# Altium project BTSM_Power_v1.PrjPcb
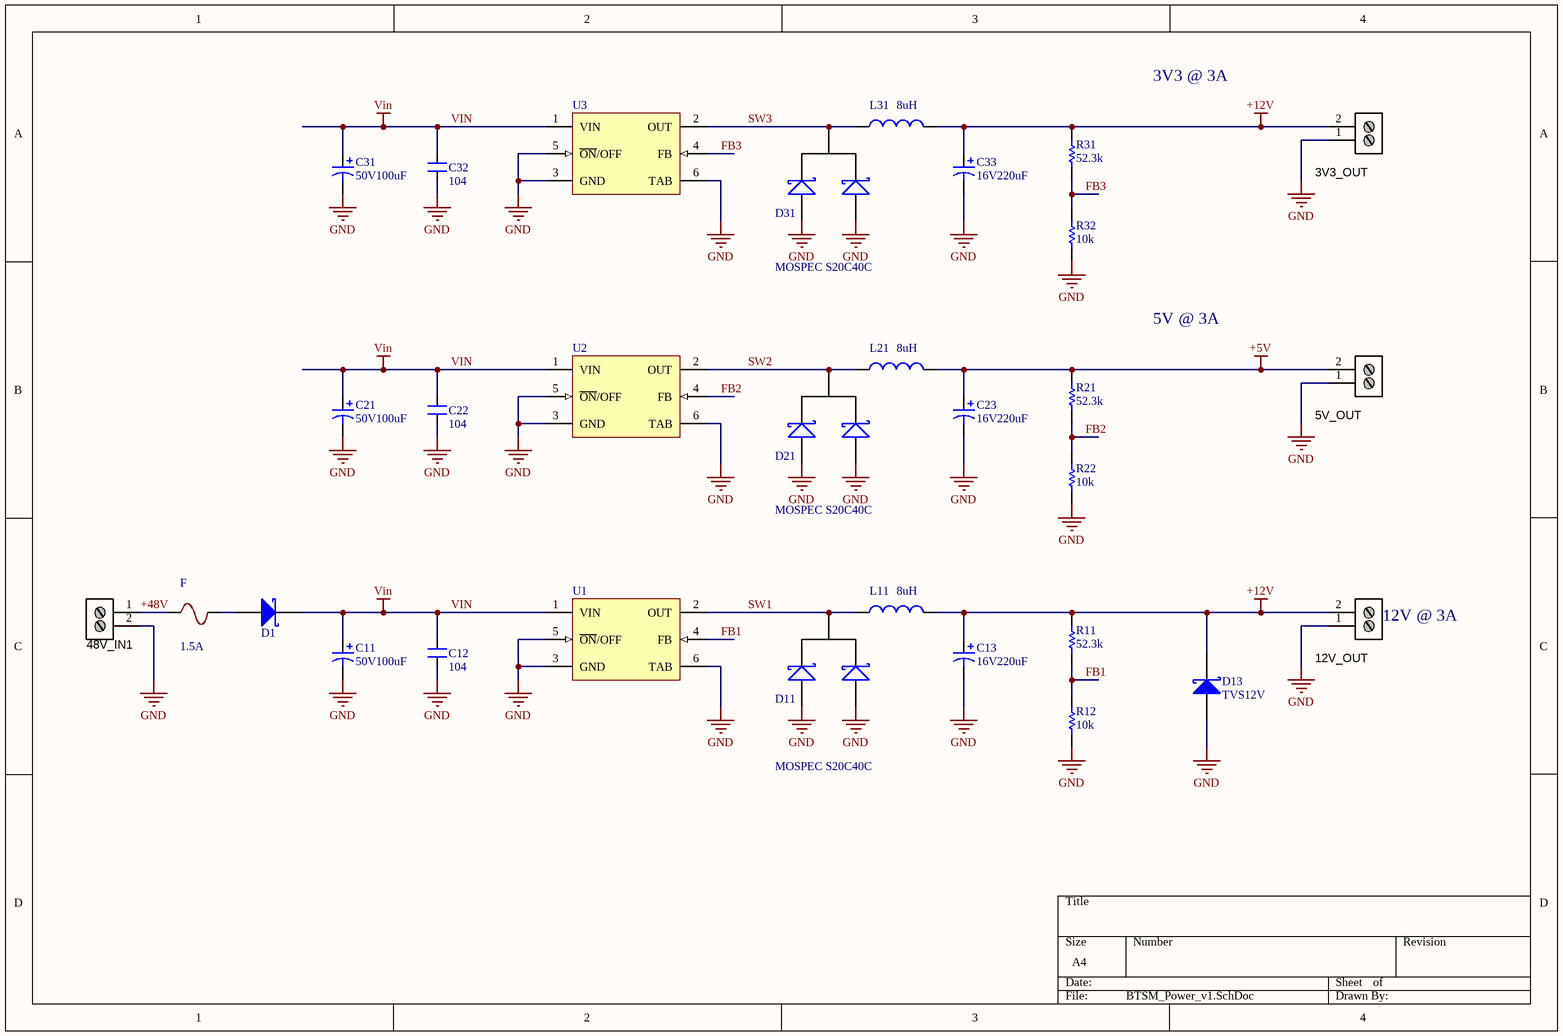
[diagram p0: BTSM_Power_v1.SchDoc]
1 sheet, 31 parts. Net scope: global (net labels, ports and power ports of the same name join across sheets).
Board file: BTSM_Power_v1.PcbDoc

## Sheet BTSM_Power_v1.SchDoc
size A4

### Parts
3V3_OUT  Stackable ScrewTerm  [2P_PCB_ScrewTerm_200mil]  (value not drawn)
5V_OUT  Stackable ScrewTerm  [2P_PCB_ScrewTerm_200mil]  (value not drawn)
12V_OUT  Stackable ScrewTerm  [2P_PCB_ScrewTerm_200mil]  (value not drawn)
48V_IN1  Stackable ScrewTerm  [2P_PCB_ScrewTerm_200mil]  (value not drawn)
C11  value 50V100uF  [CAP 3.8mm]  (hidden comment: Cap)
C12  value 104  [CAPC1608N]  (hidden comment: CAP NP)
C13  value 16V220uF  [CAP 3.8mm]  (hidden comment: Cap)
C21  value 50V100uF  [CAP 3.8mm]  (hidden comment: Cap)
C22  value 104  [CAPC1608N]  (hidden comment: CAP NP)
C23  value 16V220uF  [CAP 3.8mm]  (hidden comment: Cap)
C31  value 50V100uF  [CAP 3.8mm]  (hidden comment: Cap)
C32  value 104  [CAPC1608N]  (hidden comment: CAP NP)
C33  value 16V220uF  [CAP 3.8mm]  (hidden comment: Cap)
D1  SS14  [Diode 3A]  (value not drawn)
D11  MOSPEC S20C40C  [TO-220]
D13  TVS12V  [DO-214AA]
D21  MOSPEC S20C40C  [TO-220]
D31  MOSPEC S20C40C  [TO-220]
F  1.5A  [FUSE_SR-5-BK]
L11  value 8uH  [Toroid]  (hidden comment: Inductor)
L21  value 8uH  [Toroid]  (hidden comment: Inductor)
L31  value 8uH  [Toroid]  (hidden comment: Inductor)
R11  value 52.3k  [RESC2012N]  (hidden comment: Res)
R12  value 10k  [RESC2012N]  (hidden comment: Res)
R21  value 52.3k  [RESC2012N]  (hidden comment: Res)
R22  value 10k  [RESC2012N]  (hidden comment: Res)
R31  value 52.3k  [RESC2012N]  (hidden comment: Res)
R32  value 10k  [RESC2012N]  (hidden comment: Res)
U1  LM2596S-ADJ  [TS5B_N]  (value not drawn)
U2  LM2596S-ADJ  [TS5B_N]  (value not drawn)
U3  LM2596S-ADJ  [TS5B_N]  (value not drawn)

### Nets
+5V: 5V_OUT.2 C23.1 L21.2 R21.2
+12V: 3V3_OUT.2 12V_OUT.2 C13.1 C33.1 D13.2(K) L11.2 L31.2 R11.2 R31.2
GND: 3V3_OUT.1 5V_OUT.1 12V_OUT.1 48V_IN1.2 C11.2 C12.1 C13.2 C21.2 C22.1 C23.2 C31.2 C32.1 C33.2 D11.1(A1) D11.3(K) D13.1(A) D21.1(A1) D21.3(K) D31.1(A1) D31.3(K) R12.1 R22.1 R32.1 U1.3(GND) U1.5(~{ON}/OFF) U1.6(TAB) U2.3(GND) U2.5(~{ON}/OFF) U2.6(TAB) U3.3(GND) U3.5(~{ON}/OFF) U3.6(TAB)
VIN: C11.1 C12.2 C21.1 C22.2 C31.1 C32.2 D1.2(K) U1.1(VIN) U2.1(VIN) U3.1(VIN)
+48V: 48V_IN1.1 F.2
FB1: R11.1 R12.2 U1.4(FB)
FB2: R21.1 R22.2 U2.4(FB)
FB3: R31.1 R32.2 U3.4(FB)
SW1: D11.2(A2) L11.1 U1.2(OUT)
SW2: D21.2(A2) L21.1 U2.2(OUT)
SW3: D31.2(A2) L31.1 U3.2(OUT)
NetD1_1: D1.1(A) F.1

### Notes on the sheet
- 3V3 @ 3A
- 5V @ 3A
- (near 12V_OUT) 12V @ 3A

### Library data of the parts
3V3_OUT 5V_OUT 12V_OUT 48V_IN1 = 2P_ScrewTerm_90S_3.81MM: Terminal Block Screw Type THT 2-Position 3.81mm pitch; Manufacturer 1: Tyco Electronics; Manufacturer Part Number 1: 1776113-2; Value: 2 position; Pitch: 0.150" (3.81mm); Positions Per Level: 2; Package / Case: Side Entry; 3.81mm pitch; Category: Connectors Interconnects; Color: Black; Supplier 1: Digi-Key; Supplier Part Number 1: A97976-ND
D1 D13 = Diode Schottky: pin to pad: 1>A 2>K
D11 D21 D31 = Diode x2
F = Fuse
U1-U3 = LM2596S-ADJ: SIMPLE SWITCHER Power Converter 150 KHz 3A Step-Down Voltage Regulator; Manufacturer: National Semiconductor; PackageTopMarking: NSUZXYTT*LM2596S*-ADJ P+; PowerWise: N; FirstPublished: 4-Dec-2008; DatasheetVersion: May-2002; PackageVersion: revD, Apr-2005; PackageReference: TS5B; Publisher: Altium Limited; PackageDescription: TO-263, Molded, .400 x .390 x .180in, 5 Lead, .067in Pitch, Surface Mount; CompType: Switcher; PartNumber: LM2596S-ADJ; RoHS: O; PinCount: 5; DigiKeyPartNumber: LM2596S-ADJ-ND; Code_JEDEC: MO-169-AB; ComponentLink1Description: LM2596 Datasheet; ComponentLink1URL: http://www.national.com/ds/LM/LM2596.pdf; ComponentLink2Description: LM2596 Web Page; ComponentLink2URL: http://www.national.com/pf/LM/LM2596.html; ComponentLink3Description: TS5B Package Page; ComponentLink3URL: http://www.national.com/packaging/folders/ts5b.html